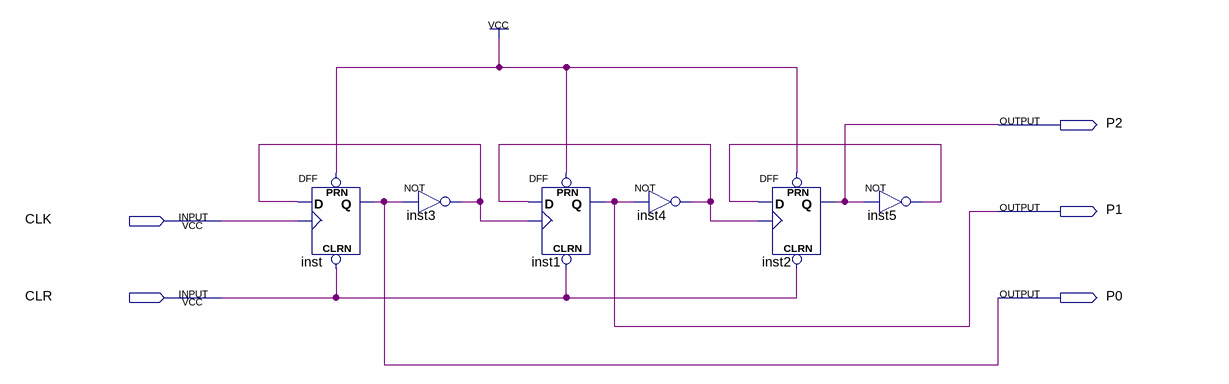
[diagram p0: schematic sheet]
// Quartus schematic Asynchronous-mode-8-Plus-1-counter.bdf as structural Verilog: 6 symbols, 5 pins
module \Asynchronous-mode-8-Plus-1-counter  (
  input  CLK,
  input  CLR,
  output P2,
  output P1,
  output P0
);

  wire inst3_out, inst4_out, inst5_out;

  DFF inst (.CLRN(CLR), .CLK(CLK), .D(inst3_out), .PRN(1'b1), .Q(P0));
  not inst3 (inst3_out, P0);
  DFF inst1 (.CLRN(CLR), .CLK(inst3_out), .D(inst4_out), .PRN(1'b1), .Q(P1));
  not inst4 (inst4_out, P1);
  DFF inst2 (.CLRN(CLR), .CLK(inst4_out), .D(inst5_out), .PRN(1'b1), .Q(P2));
  not inst5 (inst5_out, P2);
endmodule
